# Altium schematic sheet BUSConnector.SchDoc
size A4
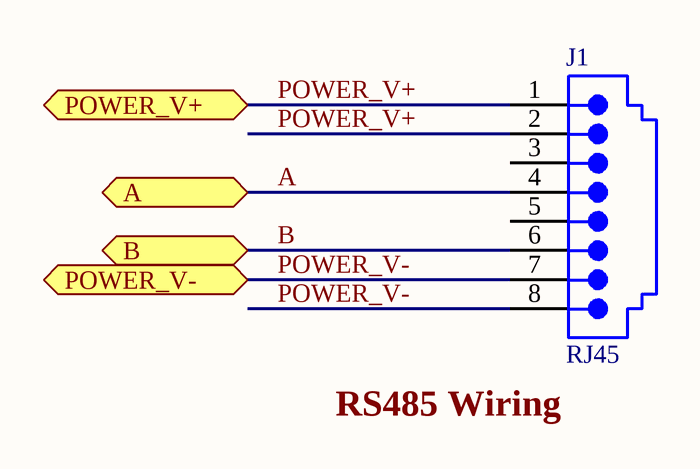
[diagram p0: BUSConnector.SchDoc]

## Parts
J1  RJ45  [15-43-6233]

## Ports
A, B, POWER_V+, POWER_V-

## Nets
A: J1.4 ; port A
B: J1.6 ; port B
POWER_V+: J1.1 J1.2 ; port POWER_V+
POWER_V-: J1.7 J1.8 ; port POWER_V-

Not connected (* = marked no-connect by the designer): J1 3 5

## Notes on the sheet
- Labels drawn without touching a wire or pin: RS485 Wiring

## Library data of the parts
J1 = 15-43-6233: Conectores modulares / Conectores Ethernet 8 PCB LO PRO R/A; MPN: 5555164-1; Supplier: Mouser; Supplier PN: 571-5555164-1; Value: RJ45